# Altium schematic sheet MOTOR.SchDoc
size A4; SheetNumber: 2; SheetTotal: 2
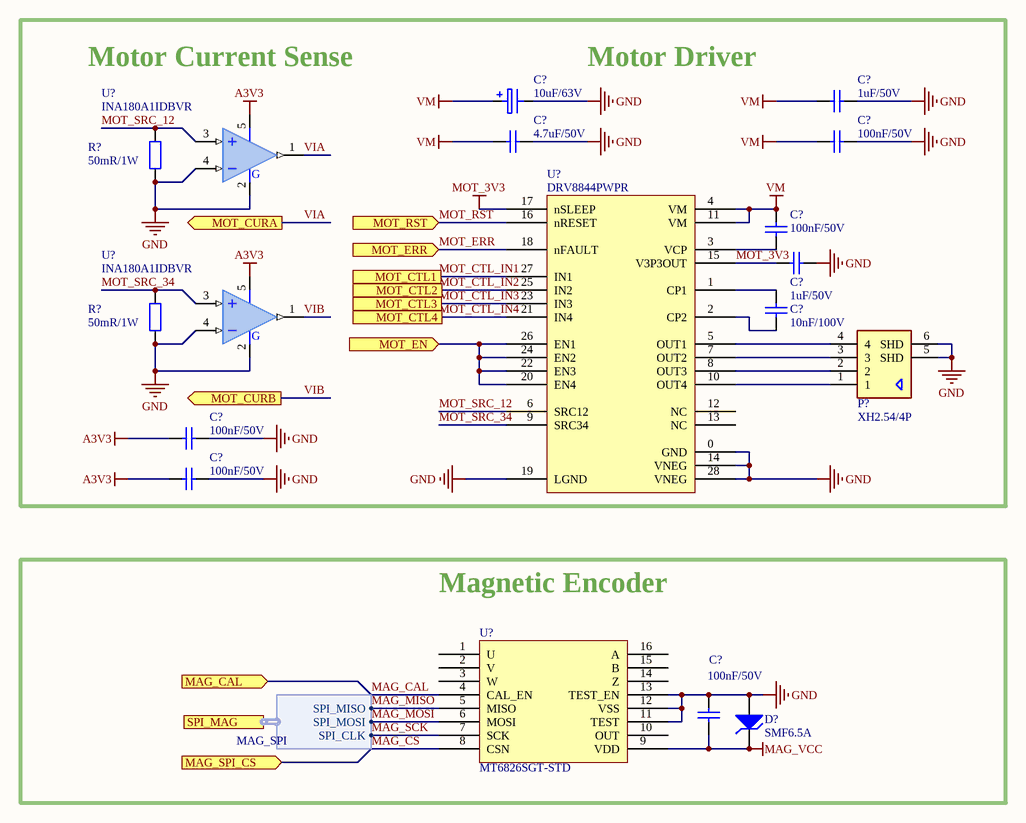
[diagram p0: MOTOR.SchDoc]

## Parts
(Parts that share a designator on the sheet are numbered #1, #2 ... from top to bottom, then left to right.)
C?#1  10uF/63V  [CAP_ELE_POLYMER_SMD_D6.3*L5.8]
C?#2  1uF/50V  [C1206]
C?#3  4.7uF/50V  [C1206]
C?#4  100nF/50V  [C0805]
C?#5  100nF/50V  [C0603]
C?#6  1uF/50V  [C0603]
C?#7  10nF/100V  [C0603]
C?#8  100nF/50V  [C0603]
C?#9  100nF/50V  [C0603]
C?#10  100nF/50V  [C0603]
D?  SMF6.5A  [SOD-123FL_TVS_UNI]
P?  XH2.54/4P  [XH2.54-4P_WT_SMT_L15.0*W7.8*H6.0]
R?#1  50mR/1W  [R1206]
R?#2  50mR/1W  [R1206]
U?#1  INA180A1IDBVR  [SOT-23-5]
U?#2  DRV8844PWPR  [TSSOP-28-EP_L9.8*W4.5_P0.65_EP5.62*2.94]
U?#3  INA180A1IDBVR  [SOT-23-5]
U?#4  MT6826SGT-STD  [TSSOP-16]

## Blocks framed on the sheet
Magnetic Encoder: C?#10 D? U?#4

## Ports
MAG_CAL (in), MAG_SPI_CS (in), MOT_CTL1 (in), MOT_CTL2 (in), MOT_CTL3 (in), MOT_CTL4 (in), MOT_CURA (out), MOT_CURB (out), MOT_EN (in), MOT_ERR (in), MOT_RST (in), SPI_MAG (harness MAG_SPI)

## Harnesses
MAG_SPI: SPI_MISO, SPI_MOSI, SPI_CLK

## Nets
A3V3: C?#8.1 C?#9.1 U?#1.5(VS) U?#3.5(VS)
GND: C?#1.2 C?#2.2 C?#3.2 C?#4.2 C?#6.1 C?#8.2 C?#9.2 C?#10.2 D?.1(ANODE) P?.5(SHD) P?.6(SHD) R?#1.1 R?#2.1 U?#1.2(GND) U?#1.4(IN-) U?#2.0(GND) U?#2.14(VNEG) U?#2.19(LGND) U?#2.28(VNEG) U?#3.2(GND) U?#3.4(IN-) U?#4.11(TEST) U?#4.12(VSS) U?#4.13(TEST_EN)
MAG_VCC: C?#10.1 D?.2(CATHODE) U?#4.9(VDD)
MOT_3V3: C?#6.2 U?#2.15(V3P3OUT) U?#2.17(nSLEEP)
VM: C?#1.1 C?#2.1 C?#3.1 C?#4.1 C?#5.1 U?#2.4(VM) U?#2.11(VM)
MAG_CAL: U?#4.4(CAL_EN) ; port MAG_CAL
MAG_CS: U?#4.8(CSN) ; port MAG_SPI_CS
MAG_MISO: U?#4.5(MISO) ; port SPI_MAG.SPI_MISO
MAG_MOSI: U?#4.6(MOSI) ; port SPI_MAG.SPI_MOSI
MAG_SCK: U?#4.7(SCK) ; port SPI_MAG.SPI_CLK
MOT_CTL_IN1: U?#2.27(IN1) ; port MOT_CTL1
MOT_CTL_IN2: U?#2.25(IN2) ; port MOT_CTL2
MOT_CTL_IN3: U?#2.23(IN3) ; port MOT_CTL3
MOT_CTL_IN4: U?#2.21(IN4) ; port MOT_CTL4
MOT_EN: U?#2.20(EN4) U?#2.22(EN3) U?#2.24(EN2) U?#2.26(EN1) ; port MOT_EN
MOT_ERR: U?#2.18(nFAULT) ; port MOT_ERR
MOT_RST: U?#2.16(nRESET) ; port MOT_RST
MOT_SRC_12: R?#1.2 U?#1.3(IN+) U?#2.6(SRC12)
MOT_SRC_34: R?#2.2 U?#2.9(SRC34) U?#3.3(IN+)
VIA: U?#1.1(OUT) ; port MOT_CURA
VIB: U?#3.1(OUT) ; port MOT_CURB
NetC?#5_2: C?#5.2 U?#2.3(VCP)
NetC?#7_1: C?#7.1 U?#2.2(CP2)
NetC?#7_2: C?#7.2 U?#2.1(CP1)
NetP?_1: P?.1 U?#2.10(OUT4)
NetP?_2: P?.2 U?#2.8(OUT3)
NetP?_3: P?.3 U?#2.7(OUT2)
NetP?_4: P?.4 U?#2.5(OUT1)

Not connected (* = marked no-connect by the designer): U?#2 12(NC) 13(NC); U?#4 1(U) 2(V) 3(W) 10(OUT) 14(Z) 15(B) 16(A)

## Notes on the sheet
- Motor Current Sense
- Motor Driver
- (in symbol INA180A1IDBVR) G

## Library data of the parts
C?#1 = HV1J106M0605PZ: Vendor: HONOR(荣誉); Tolerance: ±20%; Type: Polymer; Suppiler: 立创商城; Suppiler Number: C5246566; Published: 8-Jun-2000; LatestRevisionDate: 2025/8/11; LatestRevisionNote: Re-released for DXP Platform.; PackageReference: RB7.6-15; Publisher: Altium Limited; Value: 10uF/63V; Component Type: HV1J106M0605PZ; ComponentLink2Description: DataSheet
C?#2-C?#10 = Cap: Capacitor; Value: 0.1uF; Published: 8-Jun-2000; LatestRevisionDate: 17-Jul-2002; LatestRevisionNote: Re-released for DXP Platform.; PackageReference: RAD-0.3; Publisher: Altium Limited
D? = SMF6.5A: Vendor: Littelfuse(美国力特); Type: TVS; Suppiler: 立创商城; Suppiler Number: C720056; Component Type: SMF6.5A; ComponentLink2Description: DataSheet; LatestRevisionDate: 2025/8/7
P? = WAFER-XH2.54-4PWB: SMD,P=2.5mm,4P,卧贴; Vendor: XUNPU(讯普); Suppiler: 立创商城; Suppiler Number: C3029478; Component Type: WAFER-XH2.54-4PWB; Type: XH2.54/4P; ComponentLink2Description: DataSheet; LatestRevisionDate: 2025/8/8
R?#1 R?#2 = HoYH1206-1W-50mR-1%: Vendor: Milliohm(毫欧); Tolerance: ±1%; Suppiler: 立创商城; Suppiler Number: C601088; Published: 8-Jun-2000; LatestRevisionDate: 2025/8/11; LatestRevisionNote: Re-released for DXP Platform.; PackageReference: AXIAL-0.4; Publisher: Altium Limited; Value: 50mR/1W; Component Type: HoYH1206-1W-50mR-1%; Type: 1206/1W; ComponentLink2Description: DataSheet
U?#1 U?#3 = INA180A1IDBVR: low and high side voltage Output,Currrent Sense Amplifiers,Gain=20V/V.; Vendor: TI(德州仪器); Suppiler: 立创商城; Suppiler Number: C122228; Component Type: INA180A1IDBVR; Type: Current Sense Amplifiers; ComponentLink2Description: DataSheet; LatestRevisionDate: 2025/8/11
U?#2 = DRV8844PWPR: Quad 1/2 H-Bridge Driver IC; Vendor: TI(德州仪器); Suppiler: 立创商城; Suppiler Number: C177807; Component Type: DRV8844PWPR; ComponentLink2Description: DataSheet; LatestRevisionDate: 2025/8/8
U?#4 = MT6826SGT-STD: 15位高分辨率、高精度磁性角度编码器IC; Vendor: MagnTek（麦歌恩）; Suppiler: 立创商城; Suppiler Number: C27636731; Component Type: MT6826SGT-STD; ComponentLink2Description: DataSheet; LatestRevisionDate: 2025/8/7